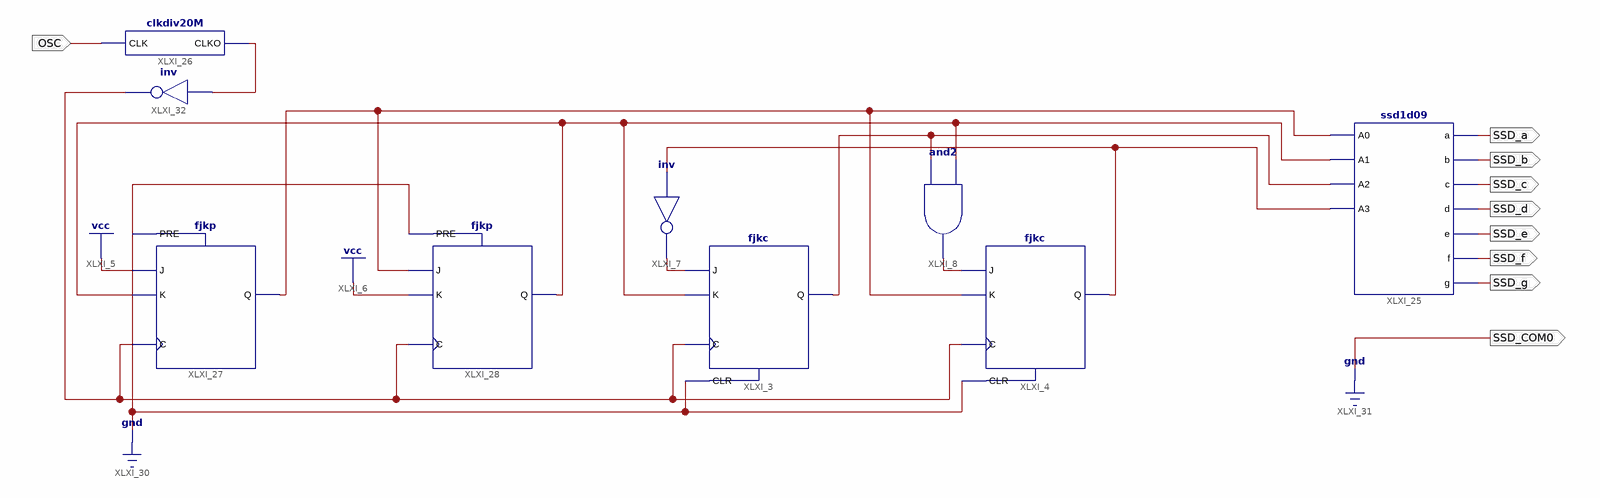
[diagram p0: schematic sheet 1]
// Xilinx ISE schematic main.sch (spartan6) as structural Verilog: 9 symbols, 9 ports
module main (
  input  OSC,
  output SSD_a,
  output SSD_b,
  output SSD_c,
  output SSD_d,
  output SSD_e,
  output SSD_f,
  output SSD_g,
  output SSD_COM0
);

  wire XLXN_5, XLXN_8, XLXN_14, XLXN_45, XLXN_46, XLXN_47, XLXN_49, XLXN_67;

  fjkc XLXI_3 (.C(XLXN_49), .CLR(1'b0), .J(XLXN_8), .K(XLXN_45), .Q(XLXN_46));
  fjkc XLXI_4 (.C(XLXN_49), .CLR(1'b0), .J(XLXN_14), .K(XLXN_5), .Q(XLXN_47));
  not XLXI_7 (XLXN_8, XLXN_47);
  and XLXI_8 (XLXN_14, XLXN_46, XLXN_45);
  ssd1d09 XLXI_25 (
    .a(SSD_a), .A0(XLXN_5), .A1(XLXN_45), .A2(XLXN_46), .A3(XLXN_47), .b(SSD_b), .c(SSD_c), .d(SSD_d),
    .e(SSD_e), .f(SSD_f), .g(SSD_g));
  clkdiv20M XLXI_26 (.CLK(OSC), .CLKO(XLXN_67));
  fjkp XLXI_27 (.C(XLXN_49), .J(1'b1), .K(XLXN_45), .PRE(1'b0), .Q(XLXN_5));
  fjkp XLXI_28 (.C(XLXN_49), .J(XLXN_5), .K(1'b1), .PRE(1'b0), .Q(XLXN_45));
  not XLXI_32 (XLXN_49, XLXN_67);

  assign SSD_COM0 = 1'b0;
endmodule
